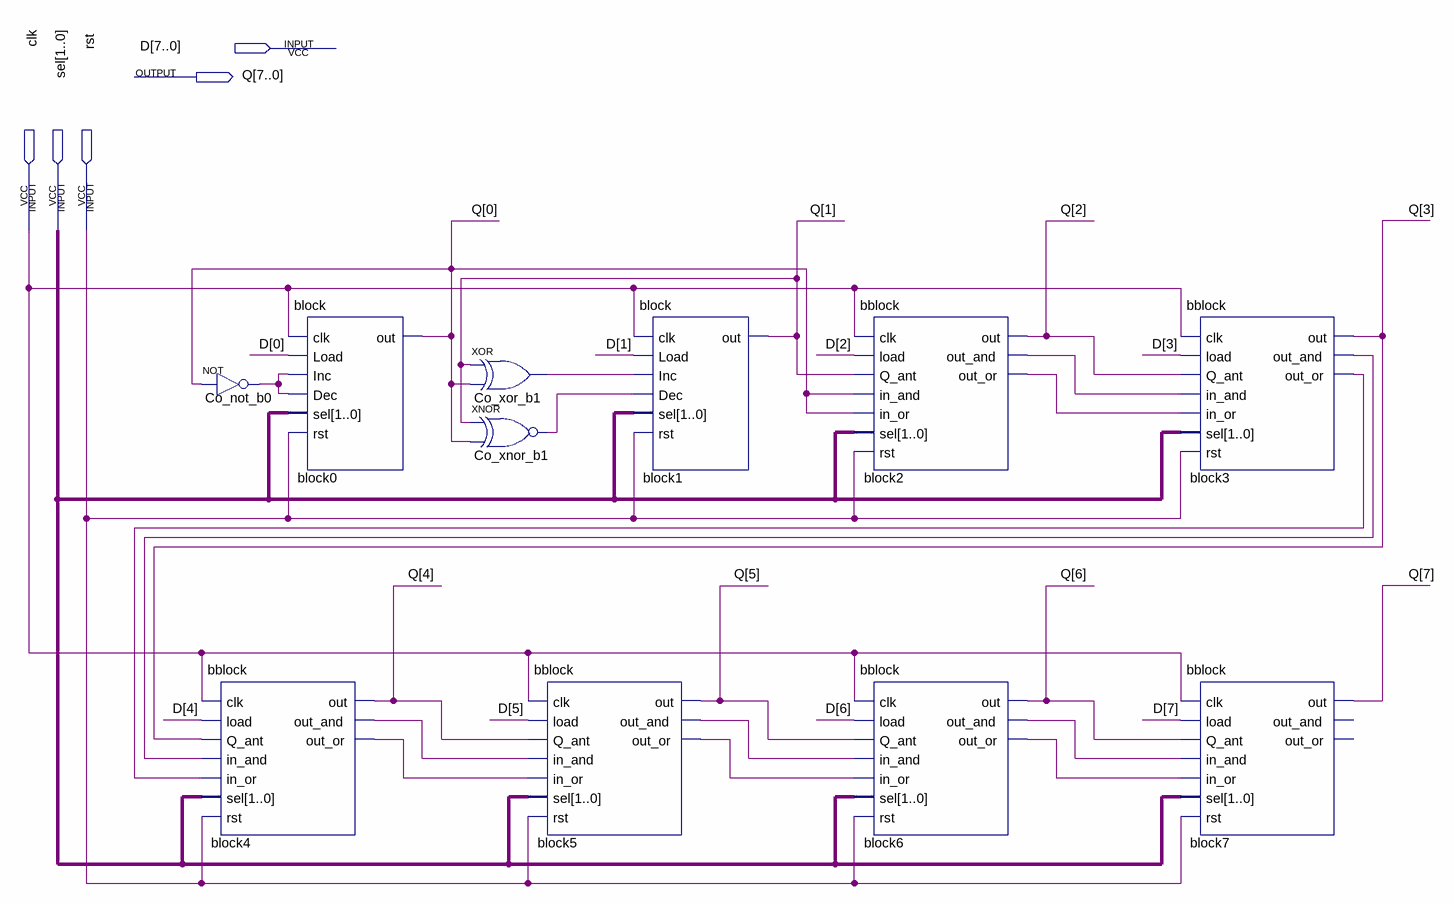
[diagram p0: schematic sheet]
// Quartus schematic synccounter.bdf as structural Verilog: 11 symbols, 5 pins
module synccounter (
  input  [7:0] D,
  input  clk,
  input  [1:0] sel,
  input  rst,
  output [7:0] Q
);

  wire block2_out_and, block2_out_or, block3_out_and, block3_out_or, block4_out_and, block4_out_or,
       block5_out_and, block5_out_or, block6_out_and, block6_out_or, Co_not_b0_out, Co_xnor_b1_out,
       Co_xor_b1_out;

  not Co_not_b0 (Co_not_b0_out, Q[0]);
  bblock block4 (
    .clk(clk), .load(D[4]), .Q_ant(Q[3]), .in_and(block3_out_and), .in_or(block3_out_or), .sel(sel),
    .rst(rst), .out(Q[4]), .out_and(block4_out_and), .out_or(block4_out_or));
  block block0 (.clk(clk), .Load(D[0]), .Inc(Co_not_b0_out), .Dec(Co_not_b0_out), .sel(sel), .rst(rst), .out(Q[0]));
  xor Co_xor_b1 (Co_xor_b1_out, Q[1], Q[0]);
  xnor Co_xnor_b1 (Co_xnor_b1_out, Q[1], Q[0]);
  bblock block5 (
    .clk(clk), .load(D[5]), .Q_ant(Q[4]), .in_and(block4_out_and), .in_or(block4_out_or), .sel(sel),
    .rst(rst), .out(Q[5]), .out_and(block5_out_and), .out_or(block5_out_or));
  block block1 (.clk(clk), .Load(D[1]), .Inc(Co_xor_b1_out), .Dec(Co_xnor_b1_out), .sel(sel), .rst(rst), .out(Q[1]));
  bblock block2 (
    .clk(clk), .load(D[2]), .Q_ant(Q[1]), .in_and(Q[0]), .in_or(Q[0]), .sel(sel), .rst(rst), .out(Q[2]),
    .out_and(block2_out_and), .out_or(block2_out_or));
  bblock block6 (
    .clk(clk), .load(D[6]), .Q_ant(Q[5]), .in_and(block5_out_and), .in_or(block5_out_or), .sel(sel),
    .rst(rst), .out(Q[6]), .out_and(block6_out_and), .out_or(block6_out_or));
  bblock block3 (
    .clk(clk), .load(D[3]), .Q_ant(Q[2]), .in_and(block2_out_and), .in_or(block2_out_or), .sel(sel),
    .rst(rst), .out(Q[3]), .out_and(block3_out_and), .out_or(block3_out_or));
  bblock block7 (
    .clk(clk), .load(D[7]), .Q_ant(Q[6]), .in_and(block6_out_and), .in_or(block6_out_or), .sel(sel),
    .rst(rst), .out(Q[7]));  // open: out_and, out_or
endmodule
